# Altium project MCX_connectors_board.PrjPcb
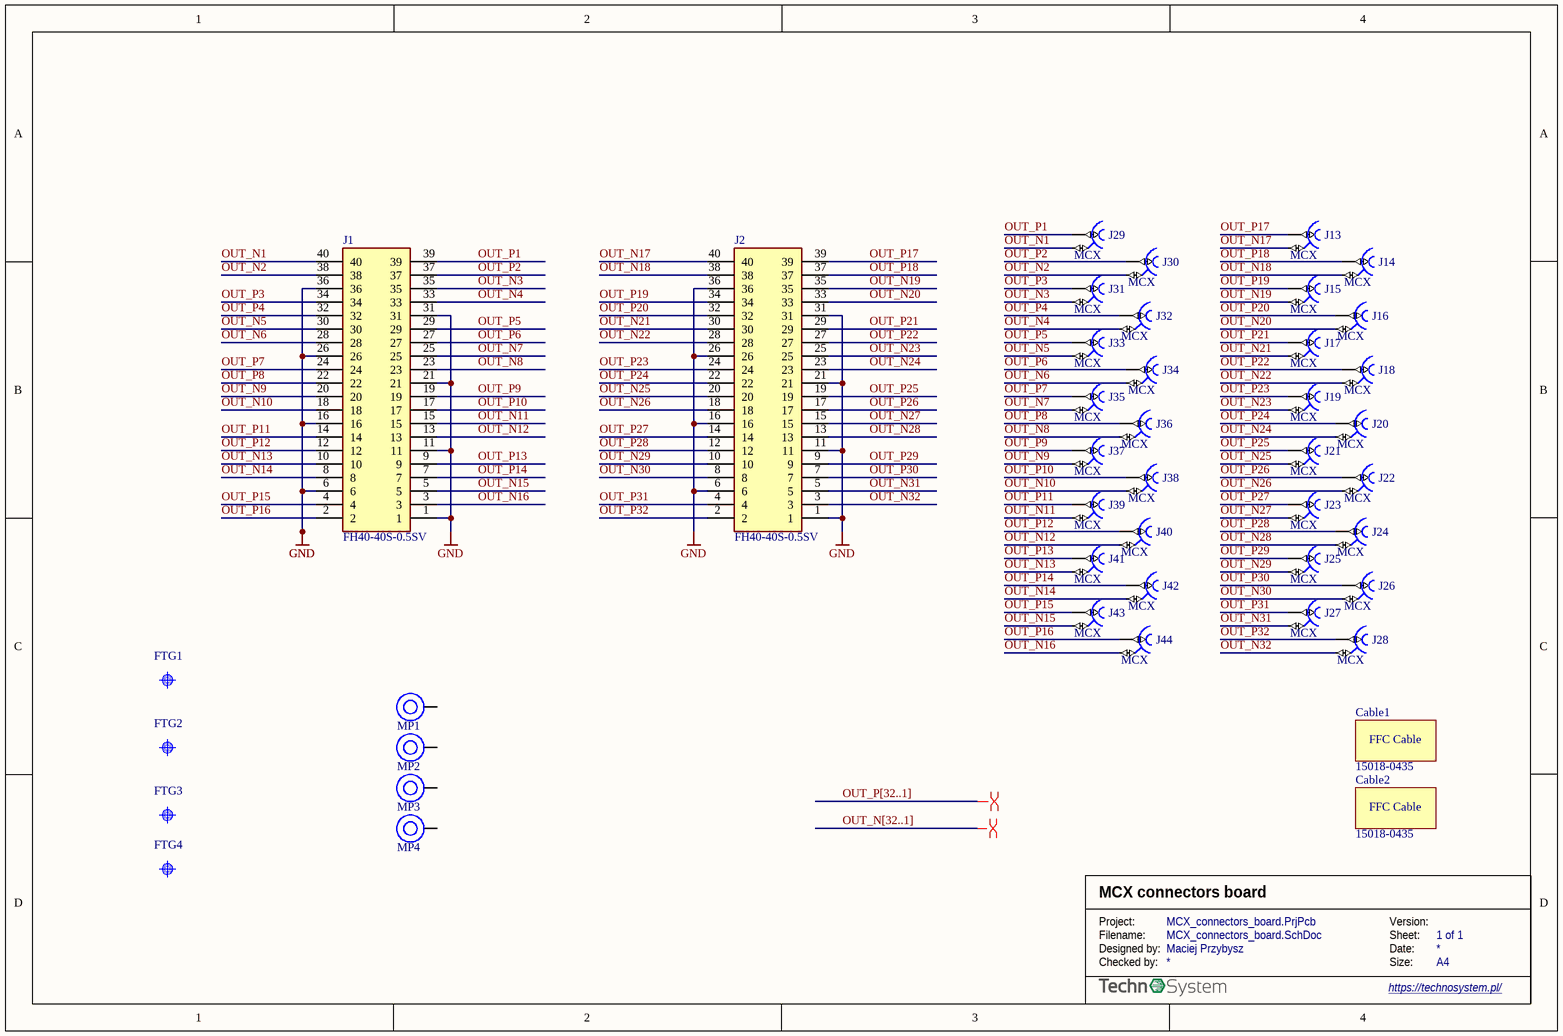
[diagram p0: MCX_connectors_board.SchDoc]
P_version: 2.0
1 sheet, 44 parts. Net scope: global (net labels, ports and power ports of the same name join across sheets).
Board files: MCX_connectors_board.PcbDoc, Panel_MCX_connectors_board.PcbDoc

## Sheet MCX_connectors_board.SchDoc: MCX connectors board
size A4; Author: Maciej Przybysz; Organization: Technosystem; Address1: Słoneczna 125, 05-506 Kolonia Lesznowola; Address2: https://technosystem.pl/; Address4: (NOT USED); DocumentNumber: 1; Revision: 0; SheetNumber: 1; SheetTotal: 1; Version: 2.0

### Parts
Cable1  15018-0435  (mechanical)
Cable2  15018-0435  (mechanical)
FTG1  Use only in PCB  [FIDUCIAL_TOP_C100-200]  (value not drawn)
FTG2  Use only in PCB  [FIDUCIAL_TOP_C100-200]  (value not drawn)
FTG3  Use only in PCB  [FIDUCIAL_TOP_C100-200]  (value not drawn)
FTG4  Use only in PCB  [FIDUCIAL_TOP_C100-200]  (value not drawn)
J1  FH40-40S-0.5SV  [FH4040S05SV]
J2  FH40-40S-0.5SV  [FH4040S05SV]
J13  MCX  [AMPHENOL_919-109J-51PX]
J14  MCX  [AMPHENOL_919-109J-51PX]
J15  MCX  [AMPHENOL_919-109J-51PX]
J16  MCX  [AMPHENOL_919-109J-51PX]
J17  MCX  [AMPHENOL_919-109J-51PX]
J18  MCX  [AMPHENOL_919-109J-51PX]
J19  MCX  [AMPHENOL_919-109J-51PX]
J20  MCX  [AMPHENOL_919-109J-51PX]
J21  MCX  [AMPHENOL_919-109J-51PX]
J22  MCX  [AMPHENOL_919-109J-51PX]
J23  MCX  [AMPHENOL_919-109J-51PX]
J24  MCX  [AMPHENOL_919-109J-51PX]
J25  MCX  [AMPHENOL_919-109J-51PX]
J26  MCX  [AMPHENOL_919-109J-51PX]
J27  MCX  [AMPHENOL_919-109J-51PX]
J28  MCX  [AMPHENOL_919-109J-51PX]
J29  MCX  [AMPHENOL_919-109J-51PX]
J30  MCX  [AMPHENOL_919-109J-51PX]
J31  MCX  [AMPHENOL_919-109J-51PX]
J32  MCX  [AMPHENOL_919-109J-51PX]
J33  MCX  [AMPHENOL_919-109J-51PX]
J34  MCX  [AMPHENOL_919-109J-51PX]
J35  MCX  [AMPHENOL_919-109J-51PX]
J36  MCX  [AMPHENOL_919-109J-51PX]
J37  MCX  [AMPHENOL_919-109J-51PX]
J38  MCX  [AMPHENOL_919-109J-51PX]
J39  MCX  [AMPHENOL_919-109J-51PX]
J40  MCX  [AMPHENOL_919-109J-51PX]
J41  MCX  [AMPHENOL_919-109J-51PX]
J42  MCX  [AMPHENOL_919-109J-51PX]
J43  MCX  [AMPHENOL_919-109J-51PX]
J44  MCX  [AMPHENOL_919-109J-51PX]
MP1  9774035151R  [9774035151]  (value not drawn)
MP2  9774035151R  [9774035151]  (value not drawn)
MP3  9774035151R  [9774035151]  (value not drawn)
MP4  9774035151R  [9774035151]  (value not drawn)

### Nets
GND: J1.1 J1.6 J1.11 J1.16 J1.21 J1.26 J1.31 J1.36 J2.1 J2.6 J2.11 J2.16 J2.21 J2.26 J2.31 J2.36
OUT_N1: J1.40 J29.2
OUT_N2: J1.38 J30.2
OUT_N3: J1.35 J31.2
OUT_N4: J1.33 J32.2
OUT_N5: J1.30 J33.2
OUT_N6: J1.28 J34.2
OUT_N7: J1.25 J35.2
OUT_N8: J1.23 J36.2
OUT_N9: J1.20 J37.2
OUT_N10: J1.18 J38.2
OUT_N11: J1.15 J39.2
OUT_N12: J1.13 J40.2
OUT_N13: J1.10 J41.2
OUT_N14: J1.8 J42.2
OUT_N15: J1.5 J43.2
OUT_N16: J1.3 J44.2
OUT_N17: J2.40 J13.2
OUT_N18: J2.38 J14.2
OUT_N19: J2.35 J15.2
OUT_N20: J2.33 J16.2
OUT_N21: J2.30 J17.2
OUT_N22: J2.28 J18.2
OUT_N23: J2.25 J19.2
OUT_N24: J2.23 J20.2
OUT_N25: J2.20 J21.2
OUT_N26: J2.18 J22.2
OUT_N27: J2.15 J23.2
OUT_N28: J2.13 J24.2
OUT_N29: J2.10 J25.2
OUT_N30: J2.8 J26.2
OUT_N31: J2.5 J27.2
OUT_N32: J2.3 J28.2
OUT_P1: J1.39 J29.1
OUT_P2: J1.37 J30.1
OUT_P3: J1.34 J31.1
OUT_P4: J1.32 J32.1
OUT_P5: J1.29 J33.1
OUT_P6: J1.27 J34.1
OUT_P7: J1.24 J35.1
OUT_P8: J1.22 J36.1
OUT_P9: J1.19 J37.1
OUT_P10: J1.17 J38.1
OUT_P11: J1.14 J39.1
OUT_P12: J1.12 J40.1
OUT_P13: J1.9 J41.1
OUT_P14: J1.7 J42.1
OUT_P15: J1.4 J43.1
OUT_P16: J1.2 J44.1
OUT_P17: J2.39 J13.1
OUT_P18: J2.37 J14.1
OUT_P19: J2.34 J15.1
OUT_P20: J2.32 J16.1
OUT_P21: J2.29 J17.1
OUT_P22: J2.27 J18.1
OUT_P23: J2.24 J19.1
OUT_P24: J2.22 J20.1
OUT_P25: J2.19 J21.1
OUT_P26: J2.17 J22.1
OUT_P27: J2.14 J23.1
OUT_P28: J2.12 J24.1
OUT_P29: J2.9 J25.1
OUT_P30: J2.7 J26.1
OUT_P31: J2.4 J27.1
OUT_P32: J2.2 J28.1

Not connected (* = marked no-connect by the designer): MP1 1; MP2 1; MP3 1; MP4 1

### Buses and harness runs
bus OUT_N[32..1]
bus OUT_P[32..1]

### Layout directives
differential pair: (no net found under the mark)

### Notes on the sheet
- Project:
- Version:
- Designed by:
- Checked by:
- Filename:
- Size:
- Date:
- Sheet:
- A4
- (in symbol 15018-0435) FFC Cable

### Library data of the parts
Cable1 Cable2 = 15018-0435: FFC Jumper Cables .5mm PremoFlex 40Ckt TypeA  Au 152mm; Manufacturer Part Number: 15018-0435; Part Number: 15018-0435
FTG1-FTG4 = FIDUCIAL_TARGET_C100-200: Fiducial Target; Part Description: Round Fiducial Target, Top Layer, 1.0mm, Top Solder 2.0mm, Keepout =2.0mm; Mounted: No; Author: CERN DEM JLC; ComponentHeight: 0mm; Component Type: Standard (No BOM); CreateDate: 09.02.2010; Family: Fiducial; HelpURL: Undefined; LatestRevisionDate: 04.04.2012; PackageDescription: Round Fiducial Target, Top Layer, 1.0mm, Top Solder 2.0mm, Keepout =2.0mm; Part Number: FIDUCIAL_TARGET_C100-200; Pin Count: 1; Sense: No; SMD: Yes; Socket: No; Status: None; Component Kind: Standard (No BOM)
J1 J2 = FH40-40S-0.5SV: Connector; Manufacturer_Name: Hirose; Part Number: 798-FH40-40S-0.5SV; Datasheet Link: https://datasheet.datasheetarchive.com/originals/distributors/Datasheets-DGA16/847294.pdf; Height: 6mm; Mouser Part Number: 798-FH40-40S-0.5SV; Mouser Price/Stock: https://www.mouser.co.uk/ProductDetail/Hirose-Connector/FH40-40S-05SV/?qs=Y%252Ba6yYk543mLwEJVPI7oow%3D%3D; Manufacturer Part Number: FH40-40S-0.5SV
J13-J44 = AMPHENOL_919-109J-51PX: Part Description: 50 Ohm, RF Connector, MCX Straight PCB Receptacle Jack; Manufacturer Part Number: 919-109J-51PX (MCX6251B1-3GT30G-50); PressFit: No; Part Number: AMPHENOL_919-109J-51PX; Component Kind: Standard; Component Type: Standard; Pin Count: 5; Family: MCX; Mounted: Yes; Socket: No; SMD: No; Sense: No; Status: None; Manufacturer: AMPHENOL; ComponentHeight: 6.06mm; HelpURL: \\cern.ch\dfs\Applications\Altium\Datasheets\AMPHENOL_919-109J-51PX.pdf; Author: CERN DEM BC; CreateDate: 31.01.2019; LatestRevisionDate: 31.01.2019
MP1-MP4 = 9774035151R: WA-SMSI SMT Steel Spacer with internal Thread, OD 5.1mm, M2.5 x 3.5mm; Manufacturer: Wurth Elektronik; Surface: Tin; ComponentLink1Description: Website Link; ComponentLink1URL: https://www.we-online.com/redexpert/article/9774035151R?ad; ComponentLink2Description: Datasheet Link; ComponentLink2URL: https://www.we-online.com/redexpert/spec/9774035151R?ad; Manufacturer Part Number: 9774035151R; Category: SMT Spacers; Match Code: WA-SMSI; Mount: Surface Mount; Operating Temperature Max: 150°C; Operating Temperature Min: -55°C; Packaging: Tape and Reel; Height: 3.5mm; Inside Diameter: 3.5mm; Material: Steel; Outside Diameter: 5.1mm; Thread Size: M2.5